# EAGLE design OS-MPS_Preamp_V1 (EAGLE 9.5.2)
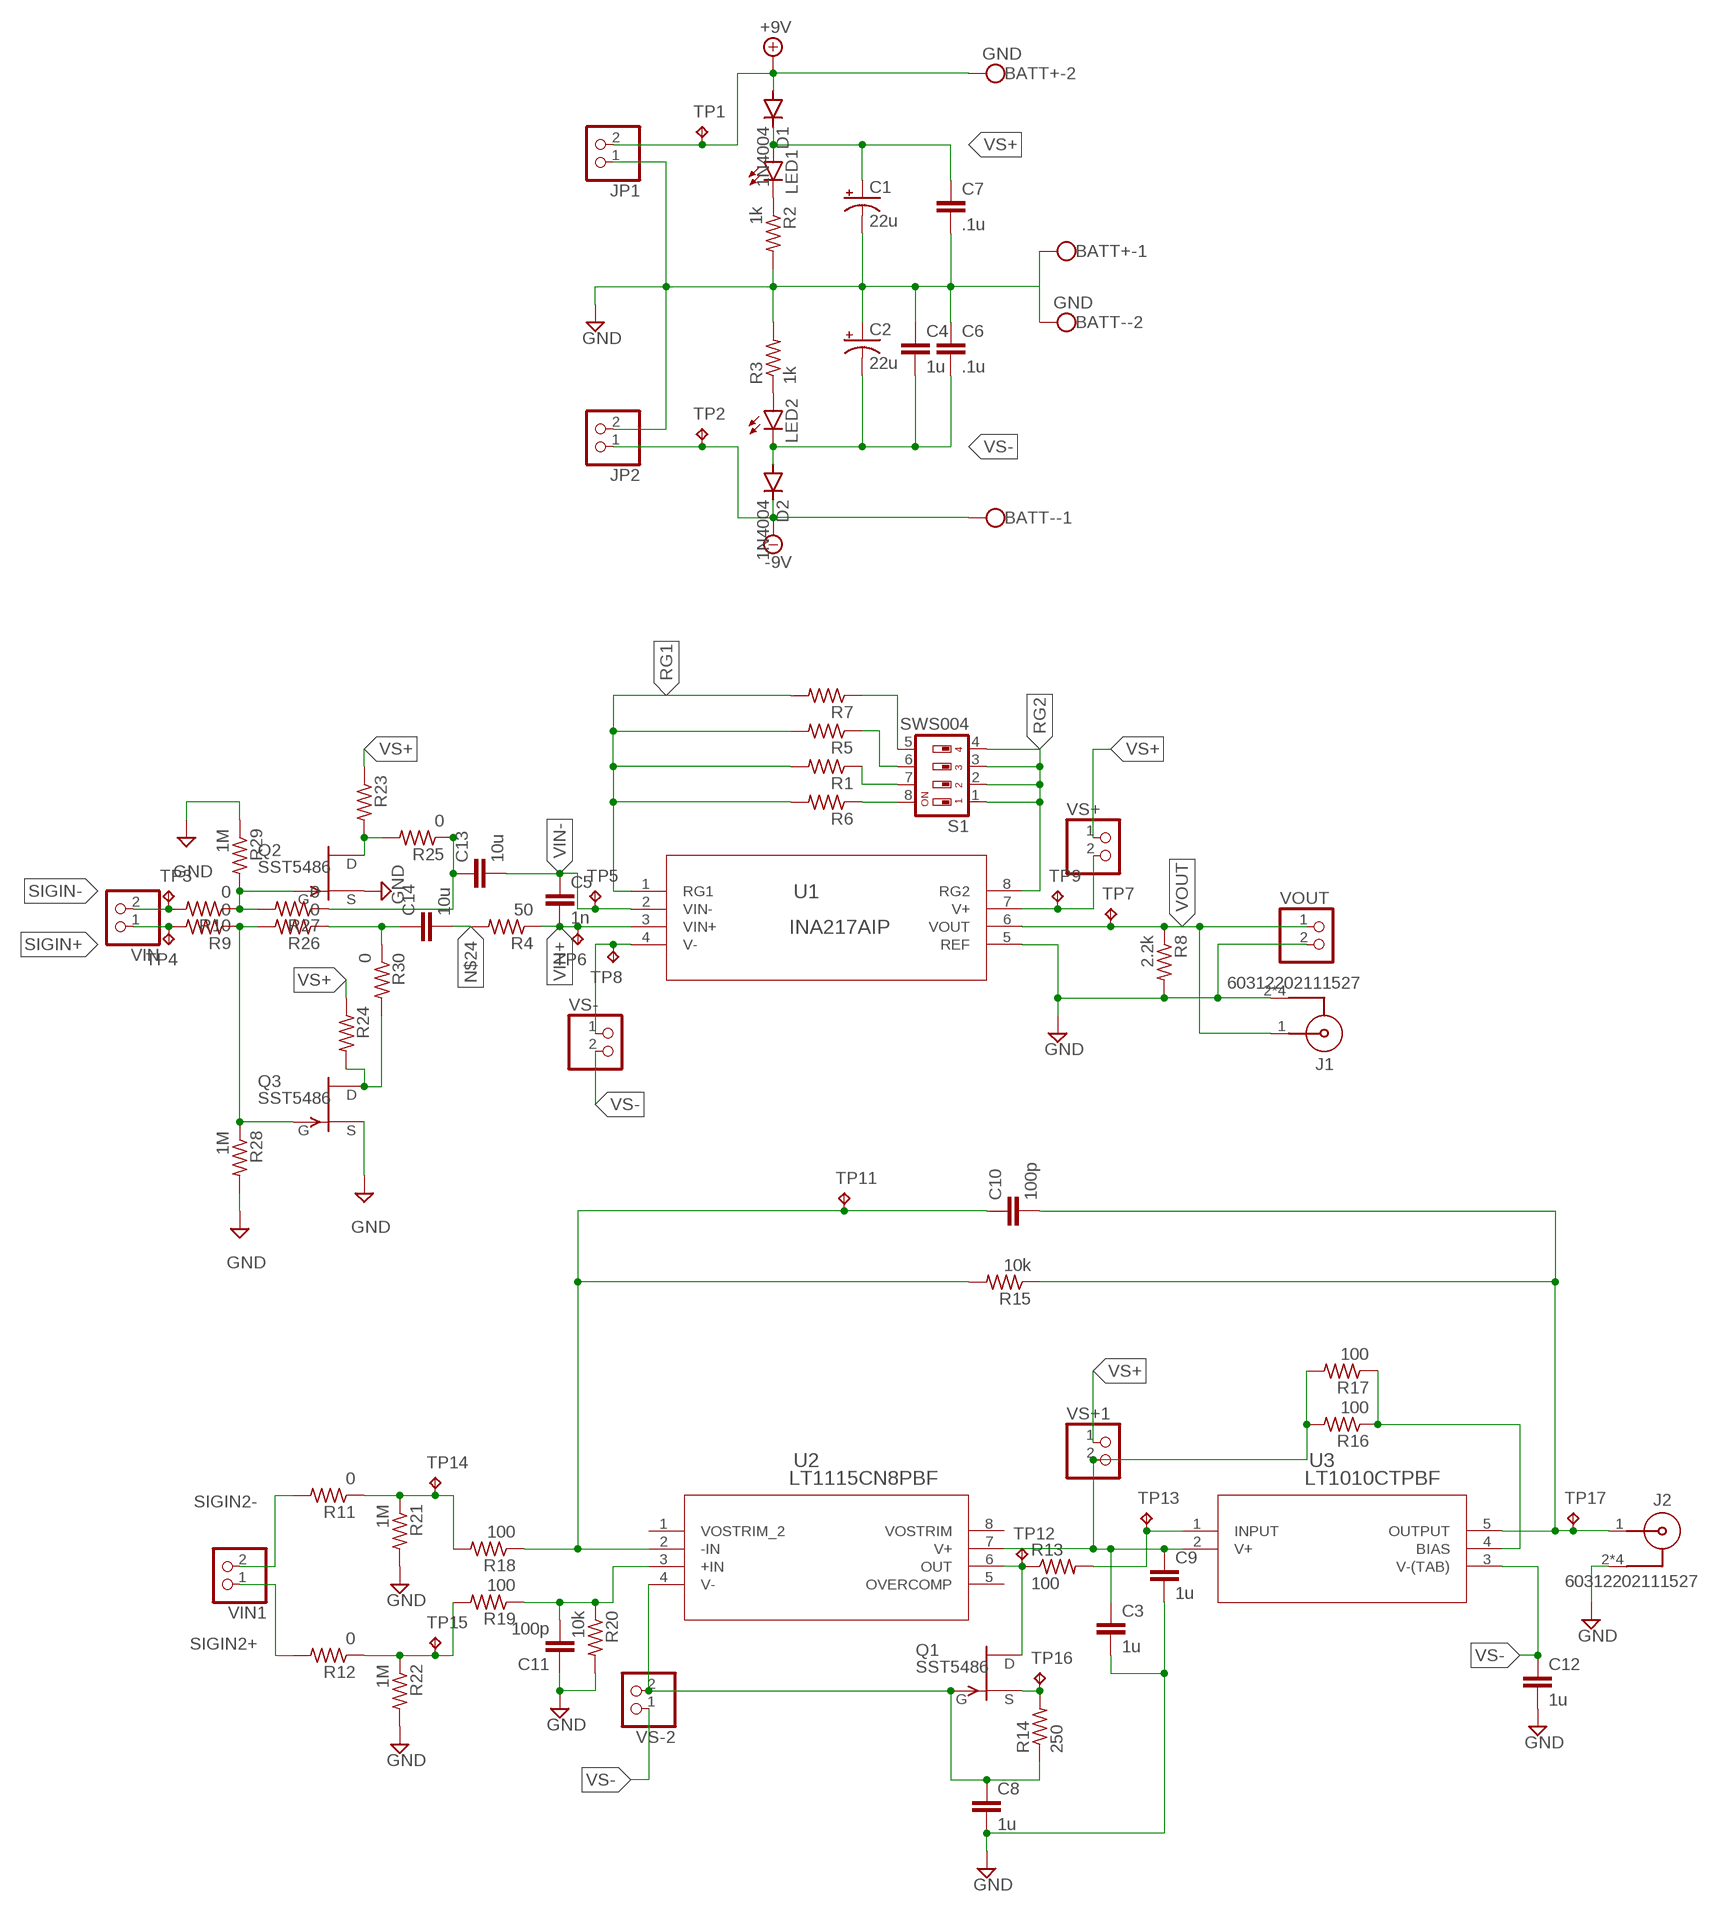
[diagram p0: schematic, sheet 1]

## Parts
BATT+  GND  W237-102  [W237-102]
BATT-  GND  W237-102  [W237-102]
C1  22u  CPOL-USTT2D6  [TT2D6]
C2  22u  CPOL-USTT2D6  [TT2D6]
C3  1u  C-EUC1206  [C1206]
C4  1u  C-EUC1206  [C1206]
C5  1n  C-EUC1206  [C1206]
C6  .1u  C-EUC1206  [C1206]
C7  .1u  C-EUC1206  [C1206]
C8  1u  C-EUC1206  [C1206]
C9  1u  C-EUC1206  [C1206]
C10  100p  C-EUC1206  [C1206]
C11  100p  C-EUC1206  [C1206]
C12  1u  C-EUC1206  [C1206]
C13  10u  C-EUC1206  [C1206]
C14  10u  C-EUC1206  [C1206]
D1  1N4004  [DO41-10]
D2  1N4004  [DO41-10]
J1  60312202111527  [60312202111527]
J2  60312202111527  [60312202111527]
JP1  PINHD-1X2  [1X02]
JP2  PINHD-1X2  [1X02]
LED1  LEDSML0805  [SML0805]
LED2  LEDSML0805  [SML0805]
Q1  SST5486  [SOT23]
Q2  SST5486  [SOT23]
Q3  SST5486  [SOT23]
R1  R-US_R0805  [R0805]
R2  1k  R-US_R0805  [R0805]
R3  1k  R-US_R0805  [R0805]
R4  50  R-US_R0805  [R0805]
R5  R-US_R0805  [R0805]
R6  R-US_R0805  [R0805]
R7  R-US_R0805  [R0805]
R8  2.2k  R-US_R0805  [R0805]
R9  0  R-US_R0805  [R0805]
R10  0  R-US_R0805  [R0805]
R11  0  R-US_R0805  [R0805]
R12  0  R-US_R0805  [R0805]
R13  100  R-US_R0805  [R0805]
R14  250  R-US_R0805  [R0805]
R15  10k  R-US_R0805  [R0805]
R16  100  R-US_R0805  [R0805]
R17  100  R-US_R0805  [R0805]
R18  100  R-US_R0805  [R0805]
R19  100  R-US_R0805  [R0805]
R20  10k  R-US_R0805  [R0805]
R21  1M  R-US_R0805  [R0805]
R22  1M  R-US_R0805  [R0805]
R23  R-US_R0805  [R0805]
R24  R-US_R0805  [R0805]
R25  0  R-US_R0805  [R0805]
R26  0  R-US_R0805  [R0805]
R27  0  R-US_R0805  [R0805]
R28  1M  R-US_R0805  [R0805]
R29  1M  R-US_R0805  [R0805]
R30  0  R-US_R0805  [R0805]
S1  SWS004  [SMS-004]
TP1  TPB2,54  [B2,54]
TP2  TPB2,54  [B2,54]
TP3  TPTP20SQ  [TP20SQ]
TP4  TPTP20SQ  [TP20SQ]
TP5  TPTP20SQ  [TP20SQ]
TP6  TPTP20SQ  [TP20SQ]
TP7  TPTP20SQ  [TP20SQ]
TP8  TPTP20SQ  [TP20SQ]
TP9  TPTP20SQ  [TP20SQ]
TP11  TPTP20SQ  [TP20SQ]
TP12  TPTP20SQ  [TP20SQ]
TP13  TPTP20SQ  [TP20SQ]
TP14  TPTP20SQ  [TP20SQ]
TP15  TPTP20SQ  [TP20SQ]
TP16  TPTP20SQ  [TP20SQ]
TP17  TPTP20SQ  [TP20SQ]
U1  INA217AIP  [P8]
U2  LT1115CN8PBF  [PDIP-8_N_LIT]
U3  LT1010CTPBF  [TO220-5_T]
VIN  PINHD-1X2  [1X02]
VIN1  PINHD-1X2  [1X02]
VOUT  PINHD-1X2  [1X02]
VS+  PINHD-1X2  [1X02]
VS+1  PINHD-1X2  [1X02]
VS-  PINHD-1X2  [1X02]
VS-2  PINHD-1X2  [1X02]

## Nets
+9V: BATT+.2 D1.A JP1.2 TP1.TP
-9V: BATT-.1 D2.C JP2.1 TP2.TP
GND: BATT+.1 BATT-.2 C1.- C2.+ C3.2 C4.1 C6.1 C7.2 C8.2 C9.2 C11.1 C12.2 J1.2 J1.3 J1.4 J1.5 J2.2 J2.3 J2.4 J2.5 JP1.1 JP2.2 Q2.2(S) Q3.2(S) R2.2 R3.2 R8.2 R20.2 R21.2 R22.2 R28.2 R29.1 U1.5(REF) VOUT.2
N$1: LED1.C R2.1
N$2: TP9.TP U1.7(V+) VS+.2
N$3: TP8.TP U1.4(V-) VS-.1
N$4: R5.1 S1.6
N$5: R1.1 S1.7
N$6: R6.1 S1.8
N$7: C11.2 R19.1 R20.1 U2.3(+IN)
N$8: R7.1 S1.5
N$9: LED2.A R3.1
N$10: C8.1 Q1.3(G) R14.1 U2.4(V-) VS-2.2
N$11: R11.1 R18.2 R21.1 TP14.TP
N$12: Q1.1(D) R13.1 TP12.TP U2.6(OUT)
N$13: R13.2 TP13.TP U3.1(INPUT)
N$14: Q1.2(S) R14.2 TP16.TP
N$15: R12.1 R19.2 R22.1 TP15.TP
N$16: C10.2 J2.1 R15.1 TP17.TP U3.5(OUTPUT)
N$17: C10.1 R15.2 R18.1 TP11.TP U2.2(-IN)
N$18: R16.1 R17.1 U3.4(BIAS)
N$19: C3.1 C9.1 R16.2 R17.2 U2.7(V+) U3.2(V+) VS+1.2
N$20: Q2.1(D) R23.2 R25.2
N$21: Q3.1(D) R24.2 R30.2
N$22: Q3.3(G) R9.1 R26.2 R28.1
N$23: Q2.3(G) R10.1 R27.2 R29.2
N$24: C14.2 R4.2
N$25: C13.1 R25.1 R27.1
RG1: R1.2 R5.2 R6.2 R7.2 U1.1(RG1)
RG2: S1.1 S1.2 S1.3 S1.4 U1.8(RG2)
SIGIN2+: R12.2 VIN1.1
SIGIN2-: R11.2 VIN1.2
SIGIN+: R9.2 TP4.TP VIN.1
SIGIN-: R10.2 TP3.TP VIN.2
VIN+: C5.2 R4.1 TP6.TP U1.3(VIN+)
VIN+_1: C14.1 R26.1 R30.1
VIN-: C5.1 C13.2 TP5.TP U1.2(VIN-)
VOUT: J1.1 R8.1 TP7.TP U1.6(VOUT) VOUT.1
VS+: C1.+ C7.1 D1.C LED1.A R23.1 R24.1 VS+1.1 VS+.1
VS-: C2.- C4.2 C6.2 C12.1 D2.A LED2.C U3.3(V-(TAB)) VS-2.1 VS-.2
Unconnected: U2.1(VOSTRIM_2) U2.5(OVERCOMP) U2.8(VOSTRIM)

## Library data of the parts
BATT+ BATT- = Favorite_Parts:W237-102: WAGO SCREW CLAMP; MPN: 237-102; OC_FARNELL: unknown; OC_NEWARK: 70K9898
C1 C2 = Favorite_Parts:CPOL-US: POLARIZED CAPACITOR, American symbol; SPICEPREFIX: C
C3-C14 = Favorite_Parts:C-EU: CAPACITOR, European symbol; SPICEPREFIX: C
D1 D2 = diode:1N4004: DIODE general purpose rectifier, 1 A
J1 J2 = Wurth_Connectors_WR-SMA:60312202111527: WR-SMA SMA PCB End Launch Jack MATERIAL PROPERTIES Insulator Material PTFE Insulator Color White Center Contact Material Beryllium Copper Center Contact Plating Gold, min. 0.076µm over Nickel Body Material Brass Body Plating Gold, min. 0.076µm over Nickel KIND PROPERTIES Interface MIL-STD-348 Connector Type SMA Gender Jack Orientation Type Straight GENERAL INFORMATION Operating Temperature -65 up to +165 °C ELECTRICAL PROPERTIES Impedance 50 Ω Frequency Range DC~18 GHz MECHANICAL PROPERTIES Mating Cycle 500 Cycles PACKAGING PROPERTIES Packaging Tray <https://katalog.we-online.com/media/images/v2/o150655v209%20Family_WR-SMA_60312202111527.jpg> Details see: https://katalog.we-online.com/en/em/WR-SMA_603122X211XXXX Updated by Ella Wu 2019-11-07 2019 (C) Würth Elektronik; DATASHEET-URL: https://www.we-online.com/catalog/datasheet/60312202111527.pdf; GENDER: Jack; INTERFACE: MIL-STD-348; MOUNT: End Launch; ORIENTATION-TYPE: Straight; PART-NUMBER: 60312202111527; Z: 50Ohm
JP1 JP2 VIN VIN1 VOUT VS+ VS+1 VS- VS-2 = Favorite_Parts:PINHD-1X2: PIN HEADER
LED1 LED2 = Favorite_Parts:LED: LED OSRAM: - CHIPLED LG R971, LG N971, LY N971, LG Q971, LY Q971, LO R971, LY R971 LH N974, LH R974 LS Q976, LO Q976, LY Q976 LO Q996 - Hyper CHIPLED LW Q18S LB Q993, LB Q99A, LB R99A - SideLED LS A670, LO A670, LY A670, LG A670, LP A670 LB A673, LV A673, LT A673, LW A673 LH A674 LY A675 LS A676, LA A676, LO A676, LY A676, LW A676 LS A679, LY A679, LG A679 - Hyper Micro SIDELED® LS Y876, LA Y876, LO Y876, LY Y876 LT Y87S - SmartLED LW L88C, LW L88S LB L89C, LB L89S, LG L890 LS L89K, LO L89K, LY L89K LS L896, LA L896, LO L896, LY L896 - TOPLED LS T670, LO T670, LY T670, LG T670, LP T670 LSG T670, LSP T670, LSY T670, LOP T670, LYG T670 LG T671, LOG T671, LSG T671 LB T673, LV T673, LT T673, LW T673 LH T674 LS T676, LA T676, LO T676, LY T676, LB T676, LH T676, LSB T676, LW T676 LB T67C, LV T67C, LT T67C, LS T67K, LO T67K, LY T67K, LW E67C LS E67B, LA E67B, LO E67B, LY E67B, LB E67C, LV E67C, LT E67C LW T67C LS T679, LY T679, LG T679 LS T770, LO T770, LY T770, LG T770, LP T770 LB T773, LV T773, LT T773, LW T773 LH T774 LS E675, LA E675, LY E675, LS T675 LS T776, LA T776, LO T776, LY T776, LB T776 LHGB T686 LT T68C, LB T68C - Hyper Mini TOPLED® LB M676 - Mini TOPLED Santana® LG M470 LS M47K, LO M47K, LY M47K Source: http://www.osram.convergy.de LUXEON: - LUMILED® LXK2-PW12-R00, LXK2-PW12-S00, LXK2-PW14-U00, LXK2-PW14-V00 LXK2-PM12-R00, LXK2-PM12-S00, LXK2-PM14-U00 LXK2-PE12-Q00, LXK2-PE12-R00, LXK2-PE12-S00, LXK2-PE14-T00, LXK2-PE14-U00 LXK2-PB12-K00, LXK2-PB12-L00, LXK2-PB12-M00, LXK2-PB14-N00, LXK2-PB14-P00, LXK2-PB14-Q00 LXK2-PR12-L00, LXK2-PR12-M00, LXK2-PR14-Q00, LXK2-PR14-R00 LXK2-PD12-Q00, LXK2-PD12-R00, LXK2-PD12-S00 LXK2-PH12-R00, LXK2-PH12-S00 LXK2-PL12-P00, LXK2-PL12-Q00, LXK2-PL12-R00 Source: www.luxeon.com KINGBRIGHT: KA-3528ASYC Source: www.kingbright.com
Q1-Q3 = transistor-fet:?548*: N-Channel JFETs Source: VISHAY 2N5484.pdf Compatible: TO92 2N5245 J304 J305 U310 J308 J309 J310 TO72 2N4416 2N4416A 2N3823 2N4351 3N169 3N170 3N171 MFE3002 TO18 2N3796 2N3797 MFE825 Source: Motorola European Master Guide Pacge 3-59
R1-R30 = Favorite_Parts:R-US_: RESISTOR, American symbol; SPICEPREFIX: R
S1 = smd-special:SWS004: SMD Dip Switch 4 pol.
TP1-TP9 TP11-TP17 = Favorite_Parts:TP: Test pad
U1 = MyParts:INA217AIP: INA217 Low noise INA; DATASHEET_URL: http://www.ti.com/lit/gpn/INA217; DESCRIPTION: Low Noise, Low-Distortion Instrumentation Amplifier Replacement for SSM2017; FAMILY_NAME: SINGLE SUPPLY; GENERIC_PART_NUMBER: INA217; INDUSTRY_STD_PKG_TYPE: PDIP; MANUFACTURER: Texas Instruments; MANUFACTURER_PART_NUMBER: INA217AIP; PACKAGE_DESIGNATOR: P; PIN_COUNT: 8; VENDOR: Texas Instruments
U2 = MyParts:LT1115CN8PBF; BUILT_BY: EMA_UL_Team; MANUFACTURER_PART_NUMBER: LT1115CN8#PBF; SOURCELIBRARY: LinearTech_2016-05-13_1; VENDOR: Linear Technology
U3 = MyParts:LT1010CTPBF: Unity gain buffer amp; BUILT_BY: EMA_UL_Team; MANUFACTURER_PART_NUMBER: LT1010CT#PBF; VENDOR: Linear Technology

## Board
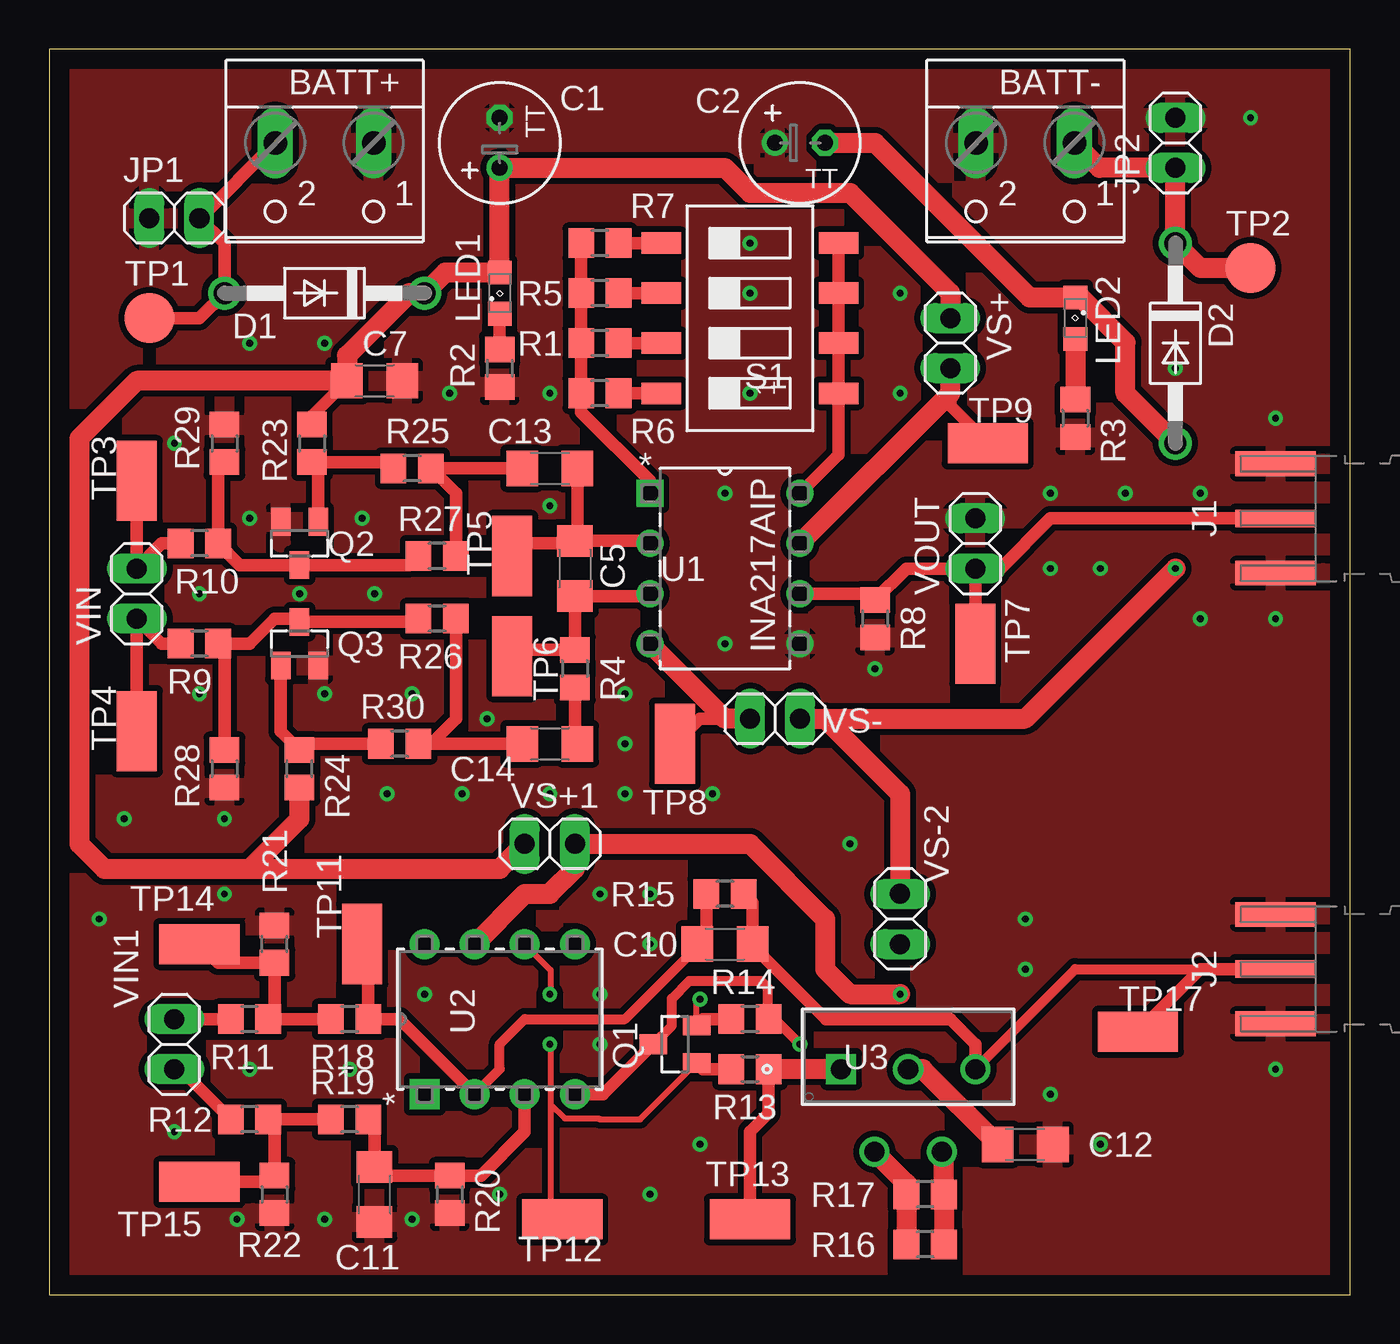
[diagram p1: board, top side]
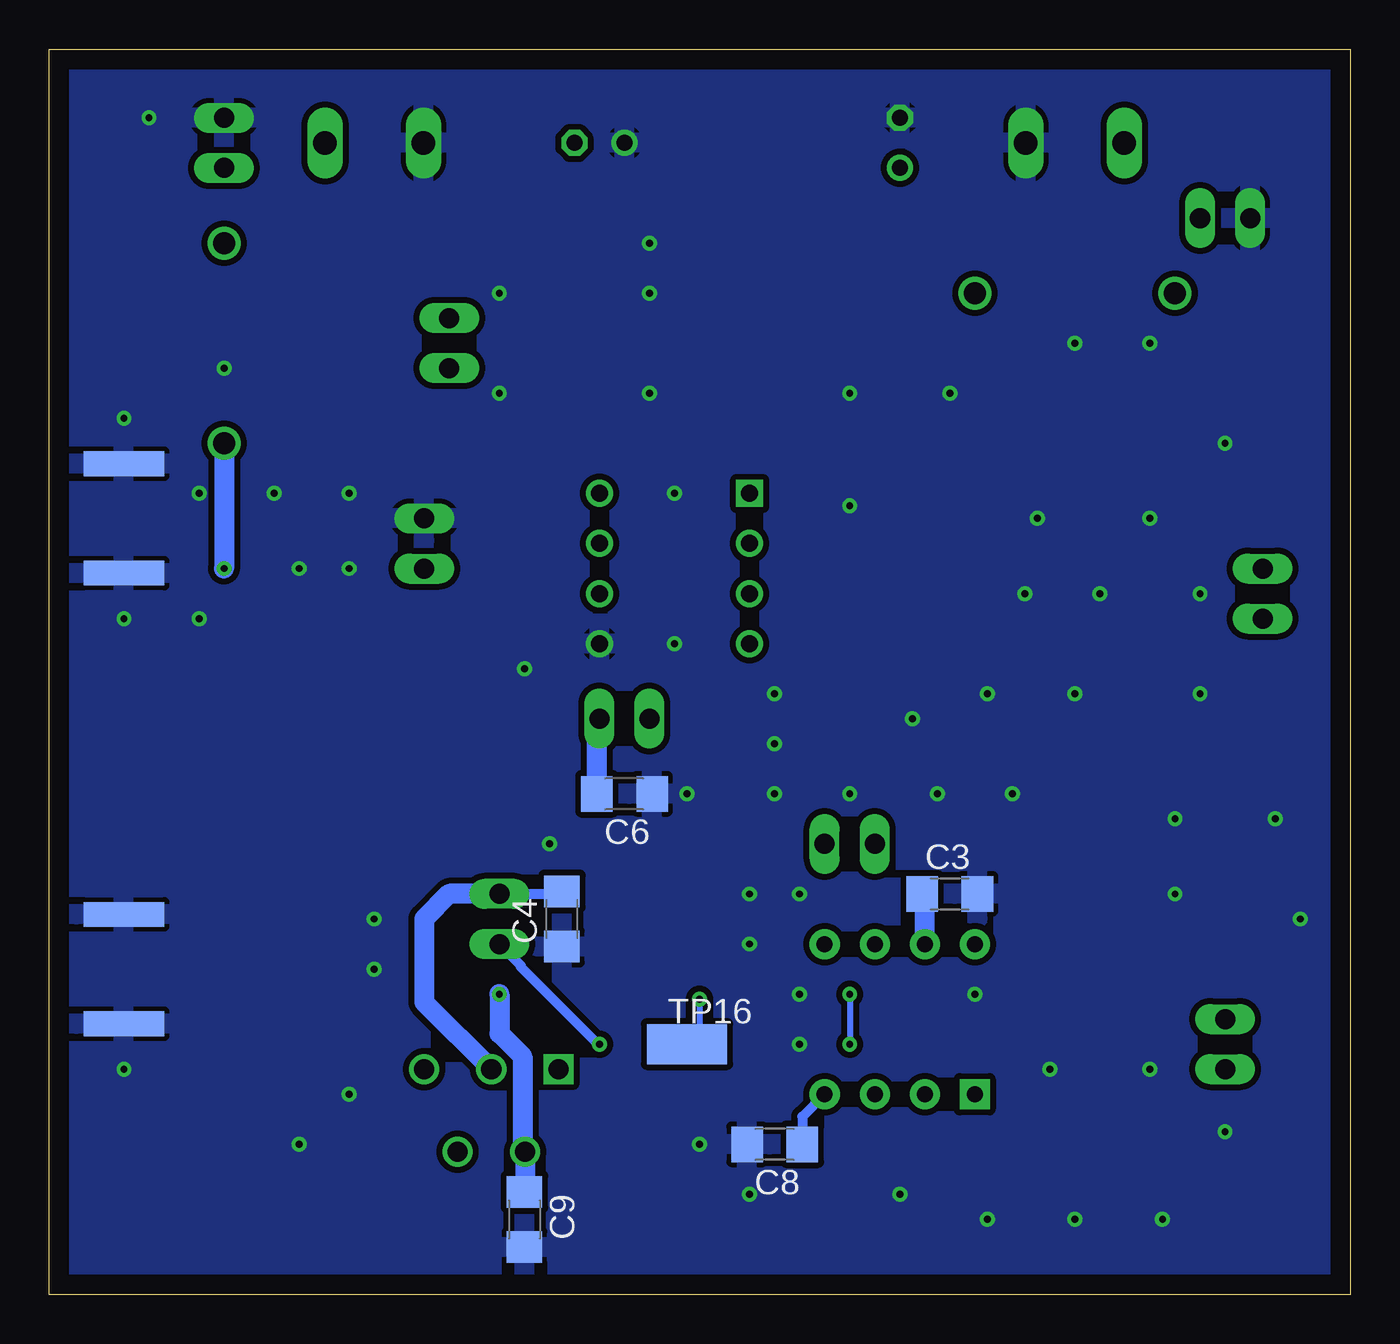
[diagram p2: board, bottom side, seen from below]

Size 66.02 x 63.17 mm. Coordinates in mm from the lower left corner, seen from the top.
Outline: 0,0 66.02,0 66.02,63.17 0,63.17 0,0
Copper layers (1*16): Top 0.035mm / dielectric 1.5mm / Bottom 0.035mm
Design rules "default *": minimum track width 6mil, minimum drill 0.35mm, track to track 12mil, track to pad 12mil, pad to pad 12mil, via to via 12mil, smd to smd 6mil, copper to edge 40mil, drill to drill 6mil, minimum pad ring 10mil, minimum via ring 8mil, stop-mask expansion 4mil, vias tented up to drill 0mil, thermal gap 10mil

### Footprints (pad centres in the part's own frame; a part is rotated, then mirrored left to right if it is on the bottom)
W237-102 = drill 1.194 long: 1 -2.5,-1.27; 2 2.5,-1.27
TT2D6 = drill 0.813: + -1.27,0 | drill 0.813 octagon: - 1.27,0
C1206 = smd 1.6 x 1.8: 1 -1.4,0; 2 1.4,0
DO41-10 = drill 1.118: A 5.08,0; C -5.08,0
60312202111527 = smd 0.9 x 4.1: 1 0,0 | smd 1.25 x 4.1: 2 -2.775,0; 3 2.775,0 | smd 1.25 x 4.1 bottom: 4 -2.775,0; 5 2.775,0
1X02 = drill 1.016 long: 1 -1.27,0; 2 1.27,0
SML0805 = smd 1.2 x 1.2: A 1.05,0; C -1.05,0
SOT23 = smd 1 x 1.4: 1 -0.95,-1.1; 2 0.95,-1.1; 3 0,1.1
R0805 = smd 1.3 x 1.5: 1 -0.95,0; 2 0.95,0
SMS-004 = smd 1.092 x 2.007: 1 -3.81,-4.496; 2 -1.27,-4.496; 3 1.27,-4.496; 4 3.81,-4.496; 5 3.81,4.496; 6 1.27,4.496; 7 -1.27,4.496; 8 -3.81,4.496
B2,54 = smd 2.54 x 2.54: TP 0,0
TP20SQ = smd 4.064 x 2.032: TP 0,0
P8 = drill 0.864 pad 1.372 square: 1 -7.62,7.62 | drill 0.864 pad 1.372: 2 -7.62,5.08; 3 -7.62,2.54; 4 -7.62,0; 5 0,0; 6 0,2.54; 7 0,5.08; 8 0,7.62
PDIP-8_N_LIT = drill 0.813 pad 1.524 square: 1 0,0 | drill 0.813 pad 1.524: 2 0,-2.54; 3 0,-5.08; 4 0,-7.62; 5 7.62,-7.62; 6 7.62,-5.08; 7 7.62,-2.54; 8 7.62,0
TO220-5_T = drill 1.016 pad 1.524 square: 1 -6.807,-1.27 | drill 1.016 pad 1.524: 2 -5.105,-5.461; 3 -3.404,-1.27; 4 -1.702,-5.461; 5 0,-1.27

### Placement (x,y rotation side)
BATT+  13.97,57.15 180 top
BATT-  49.53,57.15 180 top
C1  22.86,58.42 90 top
C2  38.1,58.42 0 top
C3  20.32,20.32 0 bottom
C4  40.01,19.05 90 bottom
C5  26.67,36.83 270 top
C6  36.83,25.4 180 bottom
C7  16.51,46.35 0 top
C8  29.21,7.62 180 bottom
C9  41.91,3.81 270 bottom
C10  34.29,17.78 0 top
C11  16.51,5.08 90 top
C12  49.53,7.62 0 top
C13  25.4,41.91 0 top
C14  25.4,27.94 0 top
D1  13.97,50.8 180 top
D2  57.15,48.26 270 top
J1  62.23,39.37 90 top
J2  62.23,16.51 90 top
JP1  6.35,54.61 0 top
JP2  57.15,58.42 90 top
LED1  22.86,50.8 90 top
LED2  52.07,49.53 270 top
Q1  31.75,12.7 90 top
Q2  12.7,38.1 180 top
Q3  12.7,33.02 0 top
R1  27.94,48.26 180 top
R2  22.86,46.99 270 top
R3  52.07,44.45 270 top
R4  26.67,31.75 270 top
R5  27.94,50.8 180 top
R6  27.94,45.72 180 top
R7  27.94,53.34 180 top
R8  41.91,34.29 270 top
R9  7.62,33.02 180 top
R10  7.62,38.1 180 top
R11  10.16,13.97 180 top
R12  10.16,8.89 180 top
R13  35.56,11.43 0 top
R14  35.56,13.97 180 top
R15  34.29,20.32 180 top
R16  44.45,2.54 180 top
R17  44.45,5.08 180 top
R18  15.24,13.97 180 top
R19  15.24,8.89 180 top
R20  20.32,5.08 270 top
R21  11.43,17.78 90 top
R22  11.43,5.08 270 top
R23  13.34,43.18 270 top
R24  12.7,26.67 90 top
R25  18.41,41.91 180 top
R26  19.68,34.29 180 top
R27  19.68,37.46 180 top
R28  8.89,26.67 270 top
R29  8.89,43.18 270 top
R30  17.78,27.94 180 top
S1  35.56,49.53 90 top
TP1  5.08,49.53 0 top
TP2  60.96,52.07 0 top
TP3  4.45,41.27 90 top
TP4  4.45,28.57 90 top
TP5  23.5,37.46 90 top
TP6  23.5,32.38 270 top
TP7  46.99,33.02 90 top
TP8  31.75,27.94 90 top
TP9  47.62,43.18 0 top
TP11  15.88,17.78 90 top
TP12  26.04,3.81 0 top
TP13  35.56,3.81 0 top
TP14  7.62,17.78 0 top
TP15  7.62,5.71 0 top
TP16  33.66,12.7 0 bottom
TP17  55.24,13.33 0 top
U1  38.1,33.02 0 top
U2  19.05,10.16 90 top
U3  46.99,12.7 0 top
VIN  4.45,35.56 90 top
VIN1  6.35,12.7 90 top
VOUT  46.99,38.1 90 top
VS+  45.72,48.26 270 top
VS+1  25.4,22.86 0 top
VS-  36.83,29.21 0 top
VS-2  43.18,19.05 270 top

### Tracks (layer width: path | path; a pad name or v marks a point on that pad's centre or on a via)
+9V
  Top 0.635: BATT+.2 7.66,54.61 JP1.2 8.89,53.34 D1.A 7.62,49.53 TP1.TP
-9V
  Top 1.016: TP2.TP 58.42,52.07 D2.C JP2.1 53.3,57.15 BATT-.1
GND  (via drill 0.35)
  other vias: 8.89,24.13 17.14,25.4 7.62,30.48 2.54,19.05 8.89,20.32 19.05,15.24 20.95,25.4 33.66,25.4 29.21,30.48 22.23,29.21 15.88,39.37 7.62,35.56 10.16,39.37 6.35,43.18 25.4,45.72 20.32,45.72 43.18,50.8 43.18,45.72 41.91,31.75 34.29,33.02 62.23,34.29 62.23,44.45 54.61,40.64 58.42,40.64 53.34,36.83 58.42,34.29 50.8,36.83 50.8,40.64 57.15,46.99 60.96,59.69 40.64,22.86 29.21,25.4 29.21,27.94 25.4,25.4 18.41,30.48 16.51,35.56 12.7,35.56 13.97,30.48 3.81,24.13 10.16,48.26 13.97,48.26 30.48,5.08 33.02,7.62 10.16,11.43 15.24,11.43 18.41,3.81 13.97,3.81 6.35,8.25 9.53,3.81 22.86,5.08 53.34,7.62 50.8,10.16 62.23,11.43 49.53,16.51 49.53,19.05 30.48,20.32 30.48,17.78 27.94,20.32 27.94,15.24 27.94,12.7 35.56,53.34 35.56,50.8 35.56,45.72 34.29,40.64 25.4,40
  pour Top: 0,63.5 0,0 64.77,0 66.04,1.27 66.04,63.5
  pour Bottom: 0,63.5 0,0 66.04,0 66.04,63.5
N$1
  Top 0.635: R2.1 LED1.C
N$2
  Top 0.635: TP9.TP 45.72,45.09 VS+.2
  Top 1.016: U1.7 45.72,45.72 VS+.2
N$3
  Top 0.635: TP8.TP 33.02,29.21 VS-.1
  Top 1.016: VS-.1 34.29,29.21 U1.4
N$4
  Top 0.635: R5.1 S1.6
N$5
  Top 0.635: R1.1 S1.7
N$6
  Top 0.635: R6.1 S1.8
N$7
  Top 0.635: R19.1 16.51,8.57 C11.2 16.96,6.03 R20.1 21.91,6.03 24.13,8.25 U2.3
N$8
  Top 0.635: R7.1 S1.5
N$9
  Top 1.016: LED2.A R3.1
N$10  (via drill 0.35)
  Top 0.508: Q1.3 31.59,13.64 31.59,15.02 32.49,15.91 36.13,15.91 36.45,15.59 36.45,14.03 R14.1 36.83,13.97 v38.1,12.7
  Top 0.635: Q1.3 28.11,10.16 U2.4
  Bottom 0.508: U2.4 27.81,9.02 C8.1 | VS-2.2 42.1,16.7 42.1,16.62 38.18,12.7 v38.1,12.7
N$11
  Top 0.635: R18.2 R11.1 11.43,14.29 R21.1 8.57,16.83 TP14.TP
N$12  (via drill 0.35)
  Top 0.305: Q1.1 29.99,8.89 27.94,8.89 27.89,8.94 26.16,8.94 25.45,9.65 | v25.4,15.24 25.45,15.29 25.45,16.46 U2.6 | v25.4,12.7 25.45,12.65 25.45,9.65 | 25.45,9.65 25.45,4.39 TP12.TP
  Top 0.635: Q1.1 33.17,11.43 R13.1
  Bottom 0.305: v25.4,15.24 v25.4,12.7
N$13
  Top 0.635: TP13.TP 35.56,8.25 36.51,9.21 R13.2
  Top 1.016: U3.1 R13.2
N$14  (via drill 0.35)
  Top 0.305: Q1.2 32.85,14.81 v33.02,14.98
  Top 0.635: Q1.2 33.17,13.97 R14.2
  Bottom 0.305: v33.02,14.98 33.02,13.33 TP16.TP
N$15
  Top 0.635: R19.2 R12.1 11.43,8.57 R22.1 11.12,5.71 TP15.TP
N$16
  Top 0.508: U3.5 52.07,16.51 J2.1
  Top 0.635: R15.1 35.69,19.87 C10.2 36.11,17.36 36.11,17.27 39.41,13.97 45.72,13.97 46.99,12.7 U3.5 | TP17.TP 58.42,16.51 J2.1
N$17
  Top 0.508: U2.2 22.86,11.43 22.86,12.7 24.13,13.97 29.21,13.97 32.89,17.65 C10.1
  Top 0.635: R15.2 33.34,18.23 C10.1 | U2.2 17.78,13.97 R18.1 16.19,17.46 TP11.TP
N$18
  Top 1.016: R16.1 R17.1 45.4,7.13 U3.4
N$19  (via drill 0.35)
  Top 1.016: U2.7 24.13,20.32 25.4,20.32 26.67,21.59 VS+1.2 35.56,22.86 39.37,19.05 39.37,16.51 40.64,15.24 v43.18,15.24 | U3.2 43.5,5.62 R17.2 R16.2
  Bottom 1.016: v43.18,15.24 43.18,13.25 42.01,12.08 42.01,7.37 U3.2 41.88,5.23 C9.1 | U2.7 21.59,20.19 C3.1
N$20
  Top 0.635: Q2.1 13.65,41.91 R23.2 17.14,42.23 R25.2
N$21
  Top 0.635: Q3.1 11.75,28.57 R24.2 13.02,27.94 R30.2
N$22
  Top 0.635: R26.2 18.57,34.12 Q3.3 12.53,34.29 11.43,34.29 10.16,33.02 R9.1 8.89,32.7 R28.1
N$23
  Top 0.635: R29.2 8.57,41.91 R10.1 9.67,37 Q2.3 18.27,37 R27.2
N$24
  Top 0.635: C14.2 26.67,28.07 R4.2
N$25
  Top 0.635: C13.1 R25.1 20.64,40.64 R27.1
RG1
  Top 0.635: U1.1 30.48,41.27 26.99,44.77 R6.2 R1.2 R5.2 R7.2
RG2
  Top 0.635: U1.8 40.06,42.6 S1.1 S1.2 S1.3 S1.4
SIGIN2+
  Top 0.635: VIN1.1 6.67,11.43 R12.2
SIGIN2-
  Top 0.635: VIN1.2 R11.2
SIGIN+
  Top 0.635: R9.2 5.71,33.02 VIN.1 TP4.TP
SIGIN-
  Top 0.635: R10.2 5.71,38.1 VIN.2 TP3.TP
VIN+
  Top 0.635: U1.3 30.35,35.43 C5.2 R4.1 23.81,32.7 TP6.TP
VIN+_1
  Top 0.635: R26.1 20.64,29.21 19.36,27.94 R30.1 C14.1
VIN-
  Top 0.635: U1.2 30.35,38.23 C5.1 26.54,38.1 26.04,38.1 | C13.2 26.8,38.86 26.04,38.1 | TP5.TP 24.13,38.1 26.04,38.1
VOUT
  Top 0.635: U1.6 41.59,35.56 R8.1 43.5,36.83 VOUT.1 | VOUT.1 48.26,36.83 50.8,39.37 J1.1 | TP7.TP VOUT.1
VS+
  Top 0.635: R23.1 13.34,44.58 C7.1
  Top 1.016: C7.1 15.11,47.62 18.29,50.8 D1.C 20.1,51.85 LED1.A C1.+ 34.29,57.15 35.56,55.88 40.64,55.88 45.72,50.8 VS+.1 | C7.1 15.24,46.22 | C7.1 4.45,46.35 1.52,43.43 1.52,22.86 2.79,21.59 10.16,21.59 | 10.16,21.59 12.7,24.13 R24.1 | 10.16,21.59 22.86,21.59 VS+1.1
VS-  (via drill 0.35)
  Top 1.016: VS-2.1 43.18,25.4 39.37,29.21 VS-.2 49.53,29.21 v57.15,36.83 | C2.- 41.91,58.42 49.75,50.58 LED2.C 52.32,50.58 54.61,48.29 54.61,45.72 D2.A | C12.1 44.32,11.43 U3.3
  Bottom 0.508: VS-2.1 40.13,20.32 C4.2
  Bottom 1.016: D2.A v57.15,36.83 | C6.2 38.23,29.08 VS-.2 | VS-2.1 45.72,20.32 46.99,19.05 46.99,14.83 U3.3